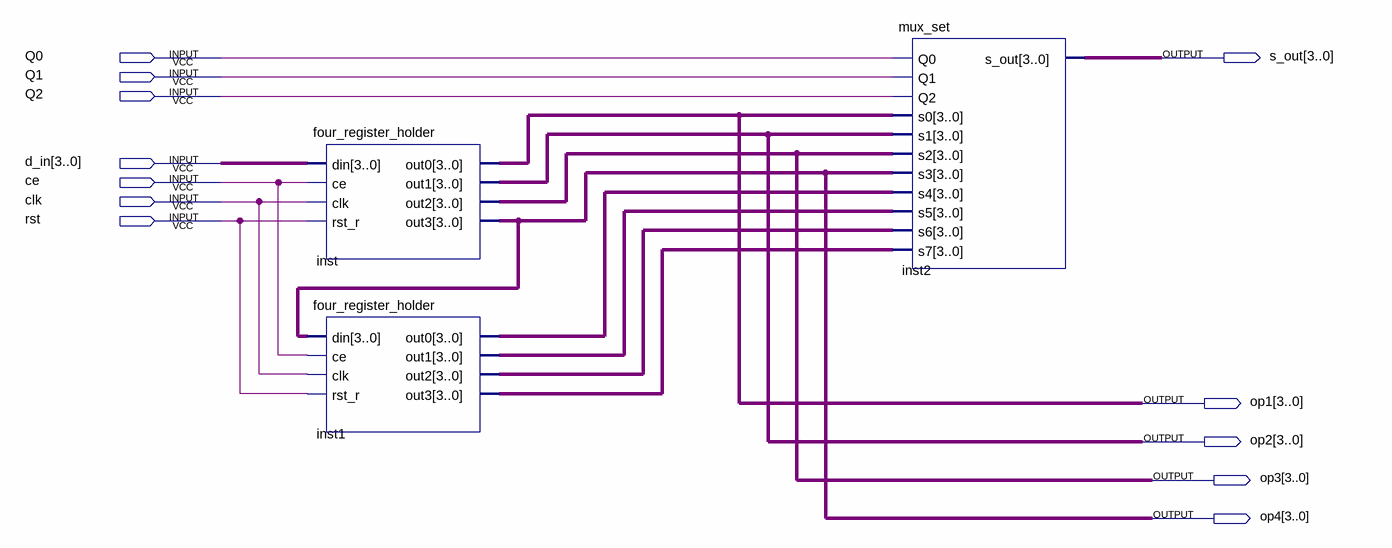
[diagram p0: schematic sheet]
// Quartus schematic myphase.bdf as structural Verilog: 3 symbols, 12 pins
module myphase (
  input  Q0,
  input  Q1,
  input  Q2,
  input  [3:0] d_in,
  input  ce,
  input  clk,
  input  rst,
  output [3:0] s_out,
  output [3:0] op1,
  output [3:0] op2,
  output [3:0] op3,
  output [3:0] op4
);

  wire [3:0] inst1_out0, inst1_out1, inst1_out2, inst1_out3;

  four_register_holder inst (
    .din(d_in), .ce(ce), .clk(clk), .rst_r(rst), .out0(op1), .out1(op2), .out2(op3), .out3(op4));
  four_register_holder inst1 (
    .din(op4), .ce(ce), .clk(clk), .rst_r(rst), .out0(inst1_out0), .out1(inst1_out1), .out2(inst1_out2),
    .out3(inst1_out3));
  mux_set inst2 (
    .Q0(Q0), .Q1(Q1), .Q2(Q2), .s0(op1), .s1(op2), .s2(op3), .s3(op4), .s4(inst1_out0), .s5(inst1_out1),
    .s6(inst1_out2), .s7(inst1_out3), .s_out(s_out));
endmodule
